# EasyEDA Pro project ICE_PRO_V1.0.epro

# Schematic Schematic1
Board Name: Board1; Create Date: 2025-08-09; Page Name: P1; Project Name: FPGA; Schematic Name: Schematic1; Update Date: 2025-08-13; Company: EasyEDA.com; Page Size: A4; Version: V1.0
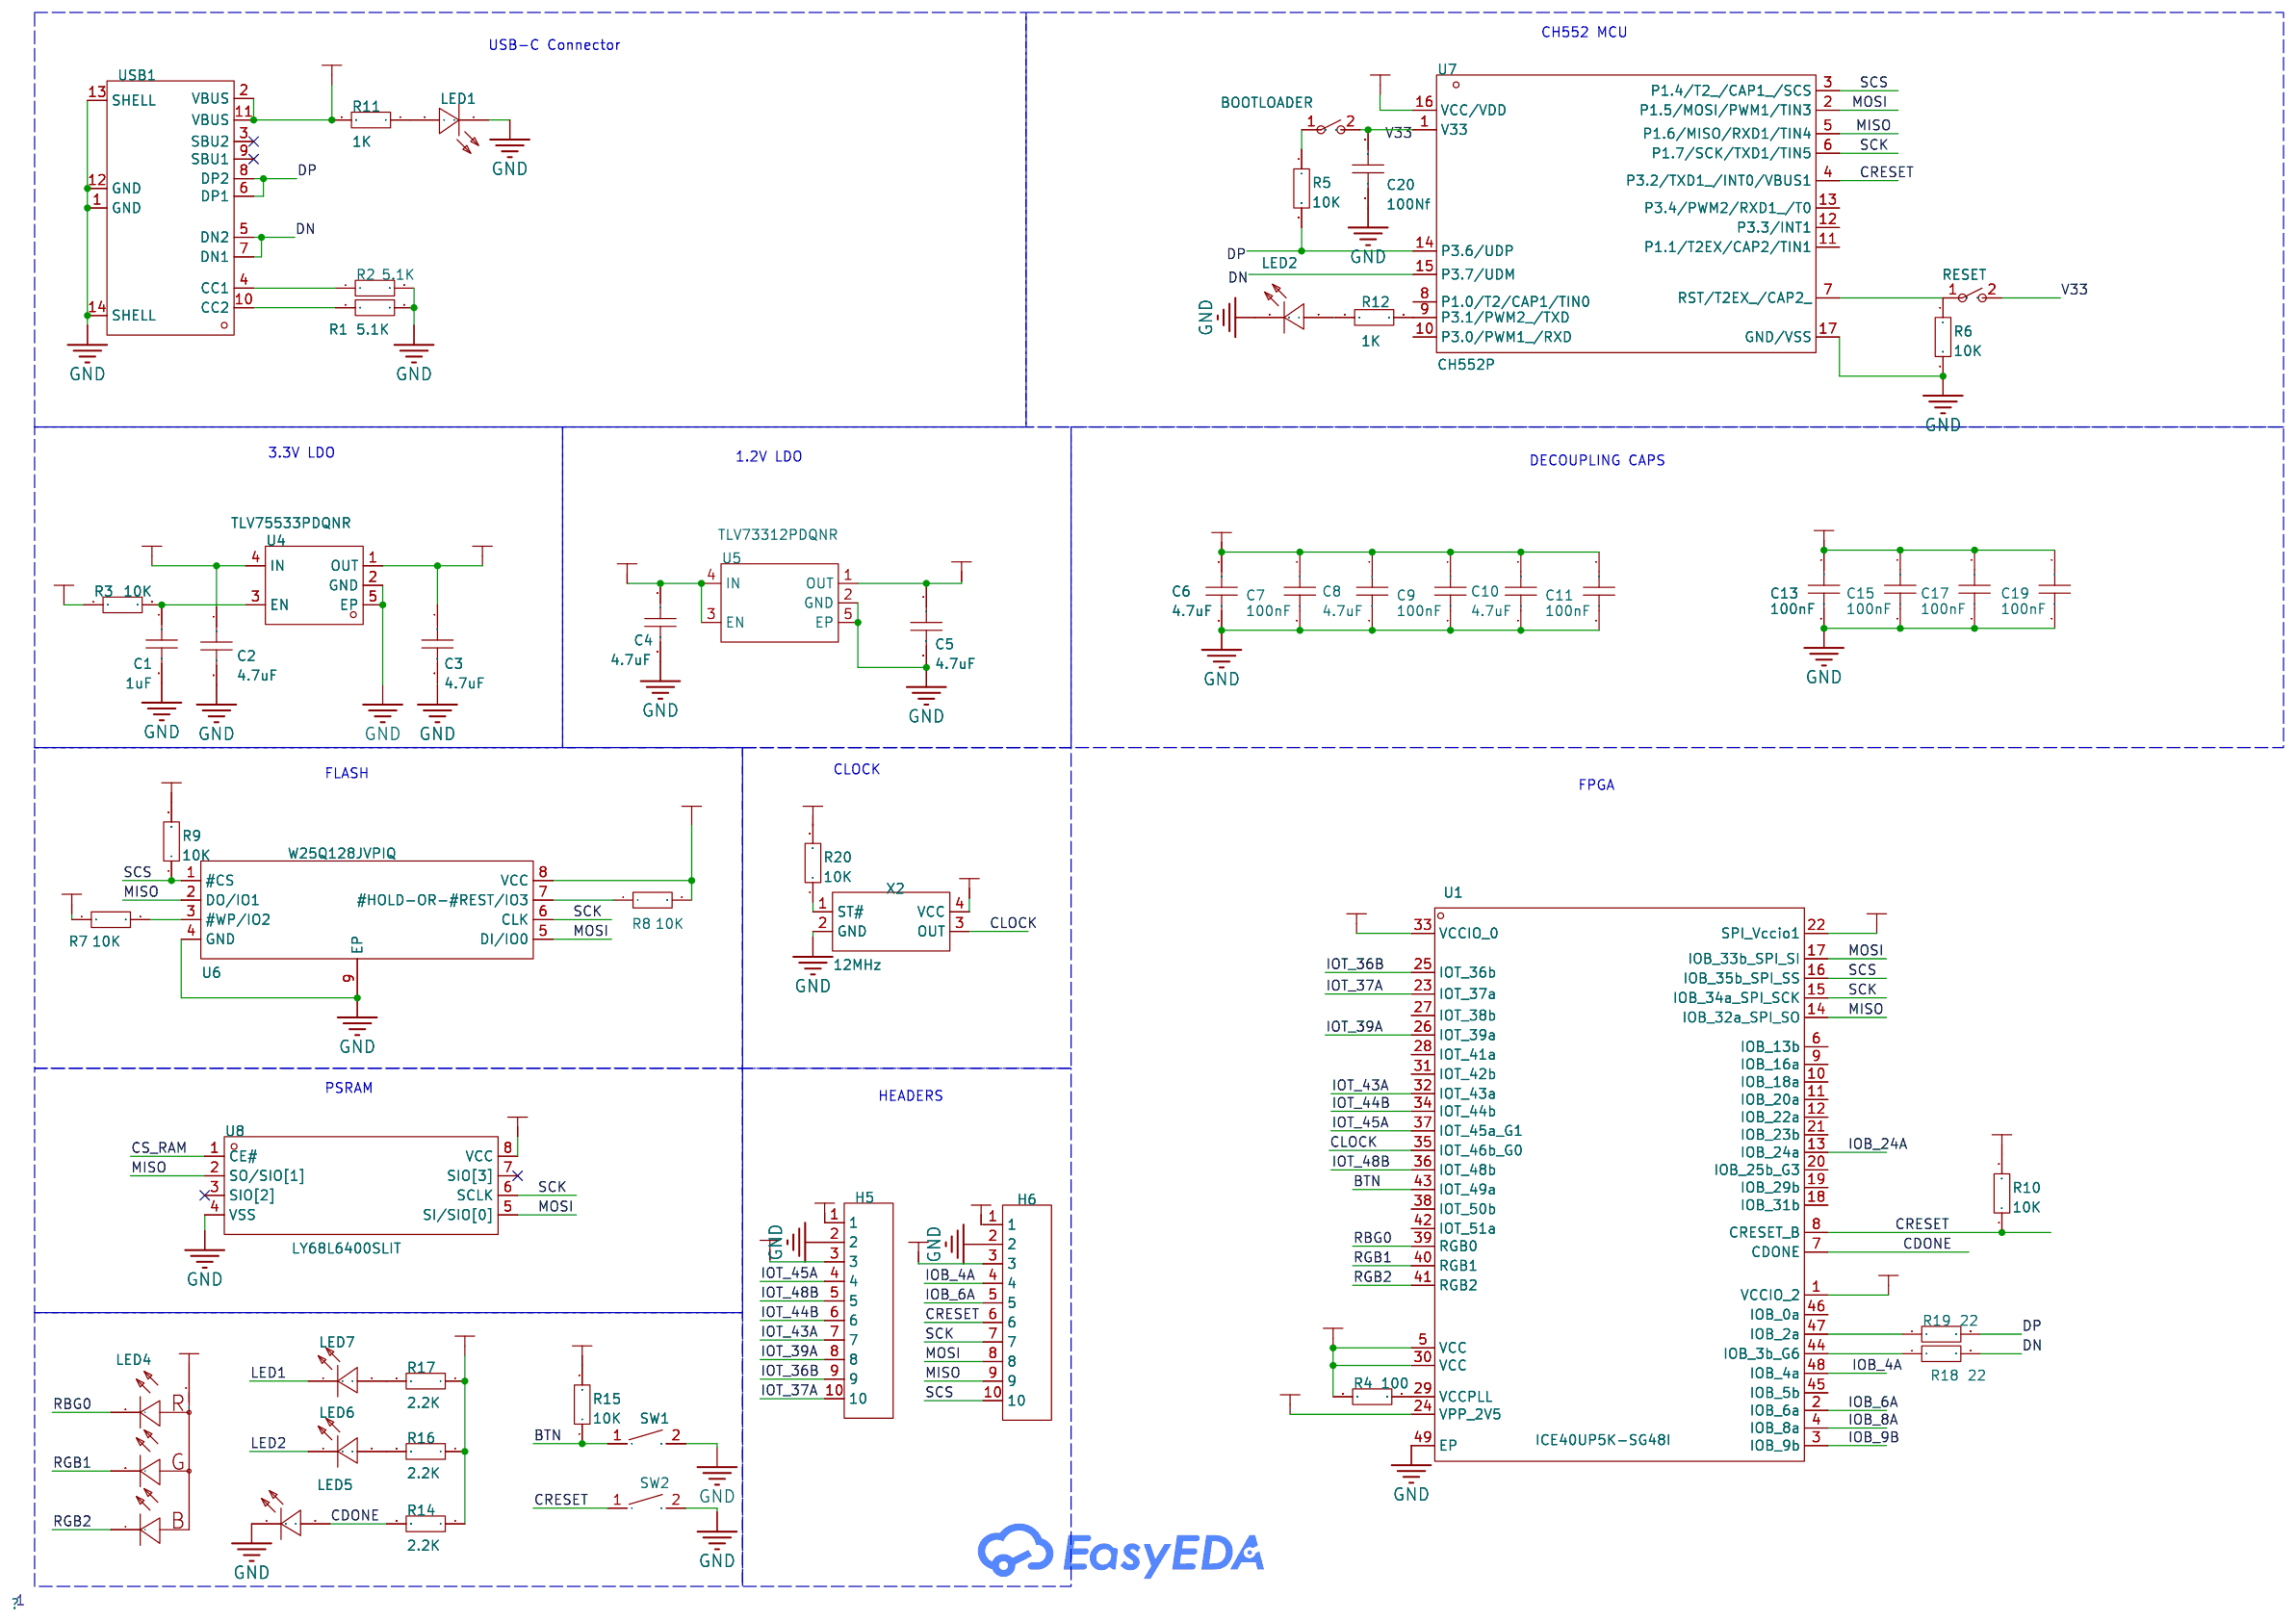
[diagram p0: schematic sheet]

## Parts
BOOTLOADER  -  [Jumper]
C1  1uF  [C0402]
C2  4.7uF  [C0402]
C3  4.7uF  [C0402]
C4  4.7uF  [C0402]
C5  4.7uF  [C0402]
C6  4.7uF  [C0402]
C7  100nF  [C0402]
C8  4.7uF  [C0402]
C9  100nF  [C0402]
C10  4.7uF  [C0402]
C11  100nF  [C0402]
C13  100nF  [C0402]
C15  100nF  [C0402]
C17  100nF  [C0402]
C19  100nF  [C0402]
C20  100Nf  [C0402]
H5  -  [HDR-TH_10P-P2.54-V-M-1]
H6  -  [HDR-TH_10P-P2.54-V-M-1]
LED1  NCD0402G1  [LED0402-RD]
LED2  NCD0402G1  [LED0402-RD]
LED4  MHPA0606RGBDT  [LED-SMD_4P-L0.7-W0.7-BL]
LED5  NCD0402G1  [LED0402-RD]
LED6  NCD0402G1  [LED0402-RD]
LED7  NCD0402G1  [LED0402-RD]
R1  5.1K  [R0402]
R2  5.1K  [R0402]
R3  10K  [R0402]
R4  100  [R0402]
R5  10K  [R0402]
R6  10K  [R0402]
R7  10K  [R0402]
R8  10K  [R0402]
R9  10K  [R0402]
R10  10K  [R0402]
R11  1K  [R0402]
R12  1K  [R0402]
R14  2.2K  [R0402]
R15  10K  [R0402]
R16  2.2K  [R0402]
R17  2.2K  [R0402]
R18  22  [R0402]
R19  22  [R0402]
R20  10K  [R0402]
RESET  -  [Jumper]
SW1  TS-1088-AR02016  [SW-SMD_L3.9-W3.0-P4.45]
SW2  TS-1088-AR02016  [SW-SMD_L3.9-W3.0-P4.45]
U1  ICE40UP5K-SG48I  [QFN-48_L7.0-W7.0-P0.50-TL-EP5.4-1]
U4  TLV75533PDQNR  [X2SON-4_L1.0-W1.0-P0.65-TL-EP]
U5  TLV73312PDQNR  [X2SON-4_L1.0-W1.0-P0.65-TL-EP]
U6  W25Q128JVPIQ  [WSON-8_L6.0-W5.0-P1.27-BL-EP]
U7  CH552P  [VQFN-16_L3.0-W3.0-P0.50-BL-EP1.7]
U8  LY68L6400SLIT  [SOP-8_L4.9-W3.9-P1.27-LS6.0-BL]
USB1  TYPE-C 16PIN 2MD(073)  [USB-C-SMD_TYPE-C-6PIN-2MD-073]
X2  12MHz  [OSC-SMD_4P-L2.5-W2.0-BL]

## Library data of the parts
BOOTLOADER RESET = Jumper
C1-C11 C13 C15 C17 C19 C20 = CAP_0402: Supplier Part: C1525; Supplier Footprint: 0402
H5 H6 = HDR-M_2.54_1x10P: Supplier Footprint: Through
LED1 LED2 LED5-LED7 = NCD0402G1: Emitted Color:Emerald Forward Voltage (VF):2.6V~3.6V Forward Voltage (VF):2.6V~3.6V Power Dissipation:72mW Forward Current:5mA Dominant Wavelength:515nm~530nm Dominant Wavelength:515nm~530nm Lens Color:无色透明透镜 Luminous Intensity:100mcd~270mcd Luminous Inte; Supplier Part: C130723; Manufacturer: 国星光电; Supplier Footprint: 0402; Datasheet: https://atta.szlcsc.com/upload/public/pdf/source/20200820/C130723_D39B4171A1B8D8D2F39C1DC521C0922A.pdf; Supplier: LCSC; Emitted Color: Emerald; Forward Voltage (VF): 2.6V~3.6V; Power Dissipation: 72mW; Forward Current: 5mA; Dominant Wavelength: 515nm~530nm; Lens Color: 无色透明透镜; Luminous Intensity: 100mcd~270mcd; Viewing Angle: 130°; Operating Temperature: -30℃~+85℃
LED4 = MHPA0606RGBDT: Diode Configuration:Common Anode Viewing Angle:115° Lens Color:Misty Black Lens Operating Temperature:-40℃~+85℃ Operating Temperature:-40℃~+85℃; LCSC Part Name: RGB三色; Supplier Part: C404278; Manufacturer: MEIHUA(美华); Supplier Footprint: SMD-4P,0.7x0.7mm; Datasheet: https://atta.szlcsc.com/upload/public/pdf/source/20190830/C404278_3337AEE9091A4B22E4C2DEF188E64997.pdf; Supplier: LCSC; Diode Configuration: Common Anode; Viewing Angle: 115°; Lens Color: Misty Black Lens; Operating Temperature: -40℃~+85℃
R1-R12 R14-R20 = Res_0402: Supplier Footprint: 0402
SW1 SW2 = TS-1088-AR02016: Circuit:SPST Actuator Style:Round Button Operating Force:160gf Mounting Style:Brick nogging Switch Length:4mm Switch Width:3mm Switch Height:2mm Strike Gundam:不带 Contact Current:50mA Voltage Rating (DC):12V Insulation Resistance:100MΩ Actuator/Cap Color:B; LCSC Part Name: 4*3*2mm 立贴 轻触开关; Supplier Part: C720477; Manufacturer: XUNPU(讯普); Supplier Footprint: SMD; JLCPCB Part Class: Basic Part; Datasheet: https://atta.szlcsc.com/upload/public/pdf/source/20200810/C720475_60D09DD6C54279ADDB2DC25100F1CC11.pdf; Supplier: LCSC; Circuit: SPST; Actuator Style: Round Button; Operating Force: 160gf; Mounting Style: Brick nogging; Switch Length: 4mm; Switch Width: 3mm; Switch Height: 2mm; Strike Gundam: 不带; Contact Current: 50mA; Voltage Rating (DC): 12V; Insulation Resistance: 100MΩ; Actuator/Cap Color: Black; Pin Style: SMDSplicing; Mechanical Life: 10万次; Operating Temperature: -30℃~+80℃
U1 = ICE40UP5K-SG48I: Type:- Supply Voltage Range - VCCIO:- Supply Voltage Range - VCCIO:- Logic Elements / Cells:5280 Logic Array Blocks:660 Embedded Block RAM:1171456bit Operating Temperature Range:-40℃~+100℃ Operating Temperature Range:-40℃~+100℃; LCSC Part Name: ICE40UP5K SG48I; Supplier Part: C2678152; Manufacturer: LATTICE(莱迪思); Supplier Footprint: QFN-48-EP(7x7); Datasheet: https://atta.szlcsc.com/upload/public/pdf/source/20210913/C2889329_82E663D90B49CAF53877542F8A43E4F7.pdf; Supplier: LCSC; Logic Elements / Cells: 5280; Logic Array Blocks: 660; Embedded Block RAM: 1171456bit; Operating Temperature Range: -40℃~+100℃
U4 = TLV75533PDQNR: Output Type:Fixed Maximum Input Voltage:5.5V Output Voltage:3.3V Output Voltage:3.3V Output Current:500mA Power Supply Rejection Ratio (PSRR):60dB@(1kHz) Operating Temperature:-40℃~+125℃@(Tj) Operating Temperature:-40℃~+125℃@(Tj) Output Polarity:Positive; LCSC Part Name: 具有使能功能的 500mA、高 PSRR、低 IQ、低压降稳压器; Supplier Part: C2861882; Manufacturer: TI(德州仪器); Supplier Footprint: X2-SON-4-EP(1x1); Datasheet: https://www.ti.com/cn/lit/gpn/tlv755p; Supplier: LCSC; Output Type: Fixed; Maximum Input Voltage: 5.5V; Output Voltage: 3.3V; Output Current: 500mA; Power Supply Rejection Ratio (PSRR): 60dB@(1kHz); Operating Temperature: -40℃~+125℃@(Tj); Output Polarity: Positive electrode; Number of Outputs: 1
U5 = TLV73312PDQNR: Output Type:Fixed Voltage - Supply:5.5V Output Voltage:1.2V Output Voltage:1.2V Output Current:300mA Power Supply Rejection Ratio (PSRR):50dB@(1kHz) Voltage Dropout:450mV@(300mA) standby current:34uA Noise:120uVrms Features:Enable；Thermal Shutdown；Over Cu; LCSC Part Name: 具有使能功能的 300mA、低 IQ、低压降无电容稳压器; Supplier Part: C2859794; Manufacturer: TI(德州仪器); Supplier Footprint: X2-SON-4-EP(1x1); Datasheet: https://www.ti.com/cn/lit/gpn/tlv733p; Supplier: LCSC; Output Type: Fixed; Voltage - Supply: 5.5V; Output Voltage: 1.2V; Output Current: 300mA; Power Supply Rejection Ratio (PSRR): 50dB@(1kHz); Voltage Dropout: 450mV@(300mA); standby current: 34uA; Noise: 120uVrms; Features: Enable；Thermal Shutdown；Over Current Protection; Operating Temperature: -40℃~+125℃@(Tj); Output Configuration: Positive; Number of Outputs: 1
U6 = W25Q128JVPIQ: Interface:SPI Memory Size:- Clock Frequency:133MHz Voltage - Supply:2.7V~3.6V Voltage - Supply:2.7V~3.6V Program / Erase Cycles:100,000 Cycles Page Programming Time (Tpp):- Block Erase Time(tBE):120ms@(32KB) Data Retention - TDR (Year):20 Years Operating; Supplier Part: C190862; Manufacturer: Winbond(华邦); Supplier Footprint: WSON-8-EP(5x6); Datasheet: https://atta.szlcsc.com/upload/public/pdf/source/20190705/C401662_06B6D416F67ED315879B366F63A3F7C9.pdf; Supplier: LCSC; Interface: SPI; Clock Frequency: 133MHz; Voltage - Supply: 2.7V~3.6V; Program / Erase Cycles: 100,000 Cycles; Block Erase Time(tBE): 120ms@(32KB); Data Retention - TDR (Year): 20 Years
U7 = CH552P: Supplier Part: C968536; Manufacturer: WCH(南京沁恒); Supplier Footprint: QFN-16; JLCPCB Part Class: Extended Part; Datasheet: https://atta.szlcsc.com/upload/public/pdf/source/20200819/C111292_2988E0DDEDF937C7B5A075A68BF2AC9C.pdf; Supplier: LCSC
U8 = LY68L6400SLIT: Supplier Part: C261881; Manufacturer: Lyontek(来扬); Supplier Footprint: SOP-8; Datasheet: https://atta.szlcsc.com/upload/public/pdf/source/20240911/02969F97DA313F70EF438339C2DAB58E.pdf; Supplier: LCSC
USB1 = TYPE-C 16PIN 2MD(073): Connector Type:Type-C Protocol Standard:USB 3.1 Gender:Female Mounting Type:Surface Mount, Right Angle Number of Contacts:16P Number of Ports:1 Current Rating-Power:3A Voltage Rating:5V Connect-Disconnect Life:5,000 Cycles Supplementary Features:- Center; LCSC Part Name: Type-C 母 卧贴; Supplier Part: C2765186; Manufacturer: SHOU HAN(首韩); Supplier Footprint: SMD; JLCPCB Part Class: Extended Part; Datasheet: https://item.szlcsc.com/datasheet/TYPE-C%252016PIN%25202MD(073)/2901843.html; Supplier: LCSC; Connector Type: Type-C; Protocol Standard: USB 3.1; Gender: Female; Mounting Type: Surface Mount, Right Angle; Number of Contacts: 16P; Number of Ports: 1; Current Rating-Power: 3A; Voltage Rating: 5V; Connect-Disconnect Life: 5,000 Cycles; Detection color: Black; Operating Temperature: -25℃~+85℃
X2 = X1G0041710018: Frequency:12MHz Normal temperature Frequency Tolerance:±50ppm Normal temperature Frequency Tolerance:±50ppm Output Type:CMOS Voltage - Supply:1.62V~3.63V Voltage - Supply:1.62V~3.63V Current - Supply:1.8mA Operating Temperature:-40℃~+85℃ Operating Tempera; LCSC Part Name: X1G004171001800; Supplier Part: C255991; Manufacturer: EPSON(爱普生); Supplier Footprint: SMD2520-4P; Datasheet: https://atta.szlcsc.com/upload/public/pdf/source/20240417/F9B89BA86168BF22DBC25C3B93427618.pdf; Supplier: LCSC; Normal temperature Frequency Tolerance: ±50ppm; Output Type: CMOS; Voltage - Supply: 1.62V~3.63V; Current - Supply: 1.8mA; Operating Temperature: -40℃~+85℃

## Nets
+1.2V: C5.1 C6.1 C7.1 C8.1 C9.1 C10.1 C11.1 H6.3 R4.1 U1.5(VCC) U1.30(VCC) U5.1(OUT)
+3V3: C3.1 C13.1 C15.1 C17.1 C19.1 H5.3 LED4.1(+) R7.1 R8.2 R9.2 R10.2 R14.1 R15.2 R16.1 R17.1 R20.2 U1.1(VCCIO_2) U1.22(SPI_Vccio1) U1.24(VPP_2V5) U1.33(VCCIO_0) U4.1(OUT) U6.8(VCC) U8.8(VCC) X2.4(VCC)
GND: C1.2 C2.2 C3.2 C4.2 C5.2 C6.2 C7.2 C8.2 C9.2 C10.2 C11.2 C13.2 C15.2 C17.2 C19.2 C20.1 H5.2 H6.2 LED1.1(K) LED2.1(K) LED5.1(K) R1.2 R2.2 R6.2 SW1.2 SW2.2 U1.49(EP) U4.2(GND) U4.5(EP) U5.2(GND) U5.5(EP) U6.4(GND) U6.9(EP) U7.17(GND/VSS) U8.4(VSS) USB1.1(GND) USB1.12(GND) USB1.13(SHELL) USB1.14(SHELL) X2.2(GND)
V33: C20.2 U7.1(V33)
VBUS: C2.1 C4.1 H5.1 H6.1 R3.1 R11.2 U4.4(IN) U5.3(EN) U5.4(IN) U7.16(VCC/VDD) USB1.2(VBUS) USB1.11(VBUS)
BTN: R15.1 SW1.1 U1.43(IOT_49a)
CDONE: LED5.2(A) R14.2 U1.7(CDONE)
CLOCK: U1.35(IOT_46b_G0) X2.3(OUT)
CRESET: H6.6 R10.1 SW2.1 U1.8(CRESET_B) U7.4(P3.2/TXD1_/INT0/VBUS1)
CS_RAM: U8.1(CE#)
DN: R18.2 U7.15(P3.7/UDM) USB1.5(DN2) USB1.7(DN1)
DP: R5.2 R19.2 U7.14(P3.6/UDP) USB1.6(DP1) USB1.8(DP2)
IOB_4A: H6.4 U1.48(IOB_4a)
IOB_6A: H6.5 U1.2(IOB_6a)
IOB_8A: U1.4(IOB_8a)
IOB_9B: U1.3(IOB_9b)
IOB_24A: U1.13(IOB_24a)
IOT_36B: H5.9 U1.25(IOT_36b)
IOT_37A: H5.10 U1.23(IOT_37a)
IOT_39A: H5.8 U1.26(IOT_39a)
IOT_43A: H5.7 U1.32(IOT_43a)
IOT_44B: H5.6 U1.34(IOT_44b)
IOT_45A: H5.4 U1.37(IOT_45a_G1)
IOT_48B: H5.5 U1.36(IOT_48b)
LED1: LED7.1(K)
LED2: LED6.1(K)
MISO: H6.9 U1.14(IOB_32a_SPI_SO) U6.2(DO/IO1) U7.5(P1.6/MISO/RXD1/TIN4) U8.2(SO/SIO[1])
MOSI: H6.8 U1.17(IOB_33b_SPI_SI) U6.5(DI/IO0) U7.2(P1.5/MOSI/PWM1/TIN3) U8.5(SI/SIO[0])
RBG0: LED4.2(-) U1.39(RGB0)
RGB1: LED4.3(-) U1.40(RGB1)
RGB2: LED4.4(-) U1.41(RGB2)
SCK: H6.7 U1.15(IOB_34a_SPI_SCK) U6.6(CLK) U7.6(P1.7/SCK/TXD1/TIN5) U8.6(SCLK)
SCS: H6.10 R9.1 U1.16(IOB_35b_SPI_SS) U6.1(#CS) U7.3(P1.4/T2_/CAP1_/SCS)
$1N838: R2.1 USB1.4(CC1)
$1N2580: C1.1 R3.2 U4.3(EN)
$1N10655: R7.2 U6.3(#WP/IO2)
$1N10681: R8.1 U6.7(#HOLD-OR-#REST/IO3)
$1N13098: R1.1 USB1.10(CC2)
$1N13176: LED1.2(A) R11.1
$1N14812: R4.2 U1.29(VCCPLL)
$1N18803: LED6.2(A) R16.2
$1N18868: LED7.2(A) R17.2
$1N23642: R20.1 X2.1(ST#)
$1N41099: LED2.2(A) R12.1
$1N42332: R18.1 U1.44(IOB_3b_G6)
$1N42360: R19.1 U1.47(IOB_2a)
Net-(R6-1): R6.1 U7.7(RST/T2EX_/CAP2_)

Not connected (* = marked no-connect by the designer): BOOTLOADER 1 2; R5 1; R12 2; RESET 1 2; U1 6(IOB_13b) 9(IOB_16a) 10(IOB_18a) 11(IOB_20a) 12(IOB_22a) 18(IOB_31b) 19(IOB_29b) 20(IOB_25b_G3) 21(IOB_23b) 27(IOT_38b) 28(IOT_41a) 31(IOT_42b) 38(IOT_50b) 42(IOT_51a) 45(IOB_5b) 46(IOB_0a); U7 8(P1.0/T2/CAP1/TIN0) 9(P3.1/PWM2_/TXD) 10(P3.0/PWM1_/RXD) 11(P1.1/T2EX/CAP2/TIN1) 12(P3.3/INT1) 13(P3.4/PWM2/RXD1_/T0); U8 3(SIO[2])* 7(SIO[3])*; USB1 3(SBU2)* 9(SBU1)*

## Notes on the sheet
- CH552 MCU
- USB-C Connector
- 3.3V LDO
- 1.2V LDO
- DECOUPLING CAPS
- FLASH
- CLOCK
- FPGA
- PSRAM
- HEADERS

# Board PCB1
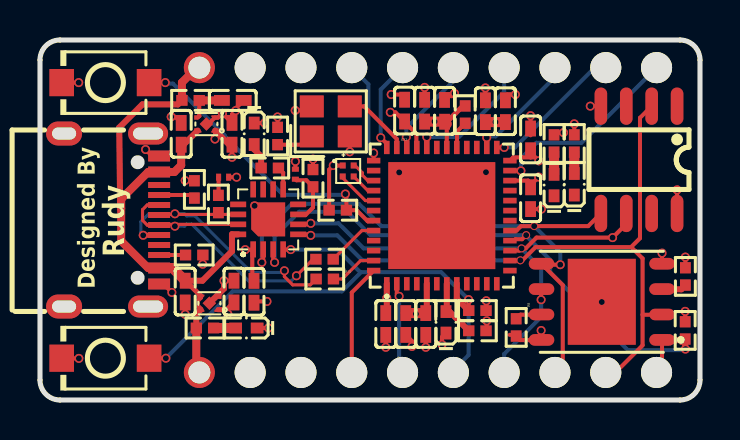
[diagram p1: board, top side]
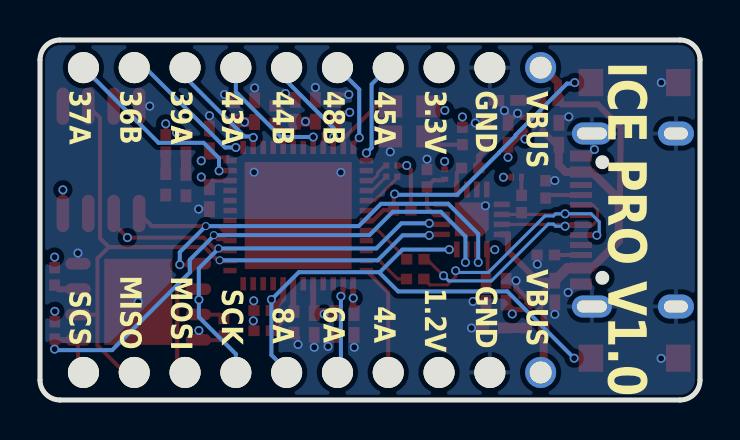
[diagram p2: board, bottom side, seen from below]

Outline 33 x 18 mm; copper layers: Top Layer, Inner1, Inner2, Bottom Layer. Coordinates in mm from the lower left corner of the outline.
Outline path: 0,17 0,1 arc(0.29,0.29) 1,0 32,0 arc(32.71,0.29) 33,1 33,17 arc(32.71,17.71) 32,18 1,18 arc(0.29,17.71) 0,17
Stack: Top Layer 0.035mm Outer layer thickness 1oz / Dielectric1 0.2104mm 7628 RC49% 8.6mil / Inner1 0.0152mm Inner layer thickness / Dielectric2 1.065mm 1.1mm H/HOZ Copper / Inner2 0.0152mm Inner layer thickness / Dielectric3 0.2104mm 7628 RC49% 8.6mil / Bottom Layer 0.035mm Outer layer thickness 1oz

## Design rules (mm)
net DN: DP1
net DP: DP1
net $1N42332: DP2
net $1N42360: DP2
template: Custom Config
spacing copperThickness1oz (default): track to track 0.102, other pairs 0.152 to 0.3
spacing copperThickness2oz: track to track 0.203, other pairs 0.152 to 0.3
track width copperThickness1oz (default): min 0.127, default 0.2, max 2.54
track width copperThickness2oz: min 0.203, default 0.254, max 2.54
differential pair differentialPair (default): width min 0.127, default 0.254, max 2.54; gap min 0.152, default 0.152
via viaSize (default): diameter min 0.4, default 0.45, max 10; hole min 0.3, default 0.3, max 6.3

## Placement (name value [footprint] x y rotation side)
BOOTLOADER  -  [Jumper]  8.73 10.94 270 top
C1  1uF  [C0402]  9.64 14.98 0 top
C2  4.7uF  [C0402]  7.06 13.31 90 top
C3  4.7uF  [C0402]  9.6 13.31 90 top
C4  4.7uF  [C0402]  7.26 5.42 270 top
C5  4.7uF  [C0402]  9.7 5.42 90 top
C6  4.7uF  [C0402]  18.29 3.8 270 top
C7  100nF  [C0402]  19.29 3.8 270 top
C8  4.7uF  [C0402]  19.23 14.47 90 top
C9  100nF  [C0402]  20.23 14.46 90 top
C10  4.7uF  [C0402]  22.27 14.44 90 top
C11  100nF  [C0402]  23.27 14.44 90 top
C13  100nF  [C0402]  18.23 14.47 90 top
C15  100nF  [C0402]  24.53 10.09 270 top
C17  100nF  [C0402]  17.29 3.8 270 top
C19  100nF  [C0402]  24.53 13.03 90 top
C20  100Nf  [C0402]  10.7 5.41 90 top
H5  -  [HDR-TH_10P-P2.54-V-M-1]  19.4 16.62 0 top
H6  -  [HDR-TH_10P-P2.54-V-M-1]  19.4 1.38 0 top
LED1  NCD0402G1  [LED0402-RD]  10.32 3.6 180 top
LED2  NCD0402G1  [LED0402-RD]  10.71 13.31 270 top
LED4  MHPA0606RGBDT  [LED-SMD_4P-L0.7-W0.7-BL]  15.41 11.45 270 top
LED5  NCD0402G1  [LED0402-RD]  20.3 3.88 90 top
LED6  NCD0402G1  [LED0402-RD]  26.71 10.79 90 top
LED7  NCD0402G1  [LED0402-RD]  25.7 10.75 90 top
R1  5.1K  [R0402]  7.71 7.25 0 top
R2  5.1K  [R0402]  7.72 10.53 90 top
R3  10K  [R0402]  7.53 14.98 0 top
R4  100  [R0402]  21.26 14.27 270 top
R5  10K  [R0402]  8.92 9.8 270 top
R6  10K  [R0402]  13.65 11.09 90 top
R7  10K  [R0402]  32.27 6.18 270 top
R8  10K  [R0402]  23.81 3.63 270 top
R9  10K  [R0402]  32.26 3.48 90 top
R10  10K  [R0402]  21.87 4.47 0 top
R11  1K  [R0402]  8.25 3.6 180 top
R12  1K  [R0402]  11.49 11.6 0 top
R14  2.2K  [R0402]  21.87 3.46 180 top
R15  10K  [R0402]  14.89 9.49 180 top
R16  2.2K  [R0402]  26.71 12.83 270 top
R17  2.2K  [R0402]  25.7 12.83 270 top
R18  22  [R0402]  14.23 7.04 180 top
R19  22  [R0402]  14.24 6.05 180 top
R20  10K  [R0402]  11.88 13.2 90 top
RESET  -  [Jumper]  12.97 10.84 0 top
SW1  TS-1088-AR02016  [SW-SMD_L3.9-W3.0-P4.45]  3.27 15.87 180 top
SW2  TS-1088-AR02016  [SW-SMD_L3.9-W3.0-P4.45]  3.27 2.09 180 top
U1  ICE40UP5K-SG48I  [QFN-48_L7.0-W7.0-P0.50-TL-EP5.4-1]  20.09 9.22 90 top
U4  TLV75533PDQNR  [X2SON-4_L1.0-W1.0-P0.65-TL-EP]  8.32 13.8 180 top
U5  TLV73312PDQNR  [X2SON-4_L1.0-W1.0-P0.65-TL-EP]  8.47 4.84 180 top
U6  W25Q128JVPIQ  [WSON-8_L6.0-W5.0-P1.27-BL-EP]  28.09 4.91 90 top
U7  CH552P  [VQFN-16_L3.0-W3.0-P0.50-BL-EP1.7]  11.41 9.03 0 top
U8  LY68L6400SLIT  [SOP-8_L4.9-W3.9-P1.27-LS6.0-BL]  29.95 12.01 180 top
USB1  TYPE-C 16PIN 2MD(073)  [USB-C-SMD_TYPE-C-6PIN-2MD-073]  3.58 9 270 top
X2  12MHz  [OSC-SMD_4P-L2.5-W2.0-BL]  14.54 13.93 0 top

## Footprints (pads in the part's own frame, mm; a bottom-side part is the same pattern mirrored in y, then rotated)
C0402
  rect 0.79x0.54 smd: 1(-0.545,0) 2(0.545,0)
HDR-TH_10P-P2.54-V-M-1
  round 1.55 hole 1.1x1.6: 1(-11.43,0)
  round 1.55 hole 1.6x1.1: 2(-8.89,0) 3(-6.35,0) 4(-3.81,0) 5(-1.27,0) 6(1.27,0) 7(3.81,0) 8(6.35,0) 9(8.89,0) 10(11.43,0)
Jumper
  custom 0.35x0.25 smd: 1(-0.2,0.2) 2(-0.2,0.7)
LED0402-RD
  rect 0.636x0.54 smd: 1(-0.538,0) 2(0.538,0)
LED-SMD_4P-L0.7-W0.7-BL
  rect 0.3x0.3 smd: 1(-0.275,-0.275) 2(-0.275,0.275) 3(0.275,0.275) 4(0.275,-0.275)
OSC-SMD_4P-L2.5-W2.0-BL
  rect 1.2x1.1 smd: 1(-0.95,-0.75) 2(0.95,-0.75) 3(0.95,0.75) 4(-0.95,0.75)
QFN-48_L7.0-W7.0-P0.50-TL-EP5.4-1
  rect 0.665x0.28 smd: 1(-3.408,2.75) 2(-3.408,2.25) 3(-3.408,1.75) 4(-3.408,1.25) 5(-3.408,0.75) 6(-3.408,0.25) 7(-3.408,-0.25) 8(-3.408,-0.75) 9(-3.408,-1.25) 10(-3.408,-1.75) 11(-3.408,-2.25) 12(-3.408,-2.75) 25(3.408,-2.75) 26(3.408,-2.25) 27(3.408,-1.75) 28(3.408,-1.25) 29(3.408,-0.75) 30(3.408,-0.25) 31(3.408,0.25) 32(3.408,0.75) 33(3.408,1.25) 34(3.408,1.75) 35(3.408,2.25) 36(3.408,2.75)
  rect 0.28x0.665 smd: 13(-2.75,-3.408) 14(-2.25,-3.408) 15(-1.75,-3.408) 16(-1.25,-3.408) 17(-0.75,-3.408) 18(-0.25,-3.408) 19(0.25,-3.408) 20(0.75,-3.408) 21(1.25,-3.408) 22(1.75,-3.408) 23(2.25,-3.408) 24(2.75,-3.408) 37(2.75,3.408) 38(2.25,3.408) 39(1.75,3.408) 40(1.25,3.408) 41(0.75,3.408) 42(0.25,3.408) 43(-0.25,3.408) 44(-0.75,3.408) 45(-1.25,3.408) 46(-1.75,3.408) 47(-2.25,3.408) 48(-2.75,3.408)
  rect 5.35x5.35 smd: 49(0,0)
R0402
  rect 0.566x0.54 smd: 1(-0.433,0) 2(0.433,0)
SOP-8_L4.9-W3.9-P1.27-LS6.0-BL
  oval 0.63x1.865 smd: 1(-1.905,-2.683) 2(-0.635,-2.683) 3(0.635,-2.683) 4(1.905,-2.683) 5(1.905,2.683) 6(0.635,2.683) 7(-0.635,2.683) 8(-1.905,2.683)
SW-SMD_L3.9-W3.0-P4.45
  rect 1.23x1.36 smd: 1(-2.185,0) 2(2.185,0)
USB-C-SMD_TYPE-C-6PIN-2MD-073
  rect 0.55x1.1 smd: 1(-3.2,2.375) 2(-2.4,2.375) 11(2.4,2.375) 12(3.2,2.375)
  rect 0.3x1.1 smd: 3(-1.75,2.375) 4(-1.25,2.375) 5(-0.75,2.375) 6(-0.25,2.375) 7(0.25,2.375) 8(0.75,2.375) 9(1.25,2.375) 10(1.75,2.375)
  oval 1.1x2 hole 0.6x1.5: 13(-4.325,1.825) 14(4.325,1.825)
  oval 1.2x1.8 hole 0.6x1.2: 13(-4.325,-2.375) 14(4.325,-2.375)
VQFN-16_L3.0-W3.0-P0.50-BL-EP1.7
  rect 0.28x0.8 smd: 1(-0.749,-1.5) 2(-0.249,-1.5) 3(0.249,-1.5) 4(0.75,-1.5) 9(0.75,1.5) 10(0.249,1.5) 11(-0.249,1.5) 12(-0.749,1.5)
  rect 0.8x0.28 smd: 5(1.5,-0.749) 6(1.5,-0.249) 7(1.5,0.249) 8(1.5,0.75) 13(-1.5,0.75) 14(-1.5,0.249) 15(-1.5,-0.249) 16(-1.5,-0.749)
  custom 1.7x1.7 smd: 17(0,0)
WSON-8_L6.0-W5.0-P1.27-BL-EP
  oval 0.581x1.276 smd: 1(-1.905,-3.013) 2(-0.635,-3.013) 3(0.635,-3.013) 4(1.905,-3.013) 5(1.905,3.013) 6(0.635,3.013) 7(-0.635,3.013) 8(-1.905,3.013)
  rect 4.3x3.4 smd: 9(0,0)
X2SON-4_L1.0-W1.0-P0.65-TL-EP
  custom 0.36x0.22 smd: 1(-0.43,0.325) 2(-0.43,-0.325) 3(0.43,-0.325) 4(0.43,0.325)
  rect 0.48x0.48 smd rot 45: 5(0,0)

## Nets
As in the schematic, except:
V33: BOOTLOADER.2 C20.2 RESET.2 U7.1
$1N7399: BOOTLOADER.1 R5.1
$1N8911: R6.1 RESET.1 U7.7
$1N41101: R12.2 U7.9

Pads without a net: U1 6 9 10 11 12 18 19 20 21 27 28 31 38 42 45 46; U7 8 10 11 12 13; U8 3 7; USB1 3 9

## Via types
v1: diameter 0.45, hole 0.3, Top Layer to Bottom Layer, 83 vias
v2: diameter 0.4, hole 0.3, Top Layer to Bottom Layer, 4 vias

## Routing (per net, layer and track width the routed paths; a pad name or vN(x,y) marks a point on that pad's centre or on a via; arc(x,y) is an arc through that point)
+1.2V: length 34.5
  Top Layer w0.2: 20.34,13.8 U1.30
  Top Layer w0.25: R4.1 21.15,14.7 20.36,13.92 ; 9.34,4.52 C5.1 ; 9.18,4.52 9.34,4.52 ; 9.18,4.52 v1(9.39,4.3) ; 9.18,4.52 U5.1
  Top Layer w0.299: C7.1 19.34,4.4 U1.5
  Top Layer w0.5: C11.1 v1(22.77,13.9) C10.1 ; 20.34,13.8 C9.1 20.22,13.92 v1(19.73,13.92) C8.1 ; C7.1 C6.1
  Inner2 w0.5: v1(22.77,13.9) 20.91,13.9 20.33,13.32 ; v1(9.39,4.3) 11.63,4.3 ; 11.63,4.3 13.05,2.89 H6.3 ; 11.63,4.3 v1(18.8,4.3) 19,4.3 20.33,5.63 20.33,13.34 19.75,13.92 v1(19.73,13.92)
+3V3: length 20.6
  Top Layer w0.2: v1(24.94,11.15) 24.64,10.85 ; v1(11.88,14.15) R20.2 ; 23.49,3.26 23.74,3.26 24,3 25.08,3 25.06,3.02 v1(25.06,3.48) ; R15.2 14.46,11.52 v1(14.66,11.73) LED4.1 ; 24.53,12.13 23.66,12.13 U1.24 ; 24.53,12.13 24.77,12.13 v1(24.94,11.96) ; 24.53,12.13 C19.1 ; R14.1 22.34,3.49 v1(22.34,3.96) ; 24.64,10.85 24.53,10.85 24.41,10.97 U1.22 ; R10.2 22.31,4.48 v1(22.31,4.96) ; C3.1 v1(9.6,12.14) ; C15.1 24.53,10.85 ; X2.4 13.39,14.48 v1(12.76,14.48) ; v1(26.71,13.81) R16.1 ; v1(32.26,4.43) 32.26,3.9 ; v1(26.17,13.37) 25.81,13.37 R17.1 ; U1.33 18.82,12.65 18.82,13.31 ; 18.82,13.31 18.23,13.9 C13.1 17.77,14.39 v1(17.52,14.39) ; v1(31.85,10.51) U8.8 ; v1(32.27,7.15) 32.27,6.6 ; U4.1 8.75,13.05
  Top Layer w0.299: U1.1 v1(17.34,5.1) 17.34,4.4 C17.1 ; 8.76,13.47 9.46,12.77 C3.1
  vias: v1(8.75,13.05)
GND: length 21.6
  Top Layer w0.2: LED2.1 v1(11.23,13.85) ; 18.23,15.2 18.16,15.28 v1(17.56,15.28) ; C10.2 v1(22.27,15.61) ; v1(9.2,5.97) C5.2 ; SW1.2 v1(1.94,15.87) ; R6.2 v1(13.65,12.04) ; v1(20.73,15.33) 20.59,15.19 20.23,15.19 ; v1(11.35,4.93) 10.76,4.93 C20.1 ; X2.2 v1(15.49,12.41) ; v1(6.56,14.16) 6.75,14.16 C2.2 ; v1(23.77,15.28) 23.37,15.28 23.27,15.17 ; LED5.1 20.1,3.15 v1(20.1,2.78) ; v1(7.26,10.97) 7.76,10.97 7.8,10.93 ; R1.2 8.14,6.8 v1(8.13,6.79) ; C4.2 v1(7.26,4.28) ; U4.5 8.42,13.8 U4.2 8.91,14.12 ; v1(5.28,12.52) 5.6,12.2 USB1.1 ; v1(31.1,7.34) 31.1,6.81 ; C15.2 v1(25.07,9.55) ; 24.53,13.23 v1(24.53,14.22) ; v1(18.6,2.68) 18.6,2.95 C6.2 ; 19.23,15.2 v1(19.23,15.63) ; 8.91,14.12 v1(9.12,14.33) ; C1.2 9.78,14.58 v1(9.78,14.47) 9.6,14.28 C3.2 9.12,14.33 ; v1(6.59,5.38) 6.17,5.8 USB1.12 ; LED1.1 v1(11.43,3.6) ; v1(17.29,2.64) C17.2 ; v1(19.29,2.64) C7.2 ; v1(27.51,14.69) U8.4 ; 1.09,2.08 v1(1.94,2.08)
  Top Layer w0.299: v1(9.2,5.97) 9.2,5.57 U5.5
  vias: v1(10.73,9.71) v1(17.96,11.38) v1(22.3,11.39) v1(28.09,4.9)
V33: length 10.5
  Top Layer w0.2: 10.66,7.52 10.66,7.52 ; 10.66,7.52 v1(10.26,7.52) ; 10.66,7.52 10.61,7.47 10.61,6.04 10.7,5.96 ; BOOTLOADER.2 v1(9.83,11.14) ; RESET.2 v1(12.77,11.93)
  Inner2 w0.299: v1(10.26,7.52) 11.63,8.89 11.63,10.1 ; 11.63,10.1 10.59,11.14 v1(9.83,11.14) ; 11.63,10.1 12.77,11.24 v1(12.77,11.93)
VBUS: length 31.5
  Top Layer w0.2: U5.3 8.04,5.11 7.88,4.94 7.88,4.74 8.04,4.57
  Top Layer w0.25: 7.35,5.89 8.04,5.2 ; 8.04,5.2 U5.3
  Top Layer w0.299: C2.1 7.18,12.77 ; C4.1 8.12,5.97 9.6,7.44 9.6,8.28 9.91,8.28 ; 7.18,12.77 7.88,13.47 ; R11.2 7.82,4.29 8.03,4.51
  Top Layer w0.3: R3.1 6.9,14.78 5.12,14.78 3.96,13.62 4.01,9.62 4.06,9.57 4.1,10.09
  Top Layer w0.399: R11.2 7.82,1.53 H6.1 ; 6.72,11.4 USB1.2 5.41,11.4 4.1,10.09 ; USB1.11 5.41,6.6 4.06,7.95 4.06,10.09 ; 4.1,10.09 4.1,10.09 ; R3.1 7.1,15.88 7.84,16.62 ; 6.72,11.4 7.06,11.74 C2.1 ; 7.96,16.69 7.76,16.69
  Top Layer w0.5: USB1.11 6.62,6.6 C4.1
BTN: length 13.8
  Top Layer w0.2: U1.43 16.65,8.94 16.38,8.94 15.83,9.49 R15.1 15.32,10.25 v1(15.27,10.3)
  Bottom Layer w0.2: v1(15.27,10.3) 15.23,10.26 12.15,10.26 10.06,12.35 10.06,12.37 9.23,13.2 9.23,13.25 6.65,15.82 6.31,15.82 v1(6.26,15.87)
CDONE: length 2.9
  Top Layer w0.299: U1.7 20.34,4.46 LED5.2 20.47,4.42 R14.2
CLOCK: length 3.4
  Top Layer w0.2: U1.35 17.84,13.05 16.21,14.68 X2.3
CRESET: length 28.8
  Top Layer w0.2: 12.16,7.52 v1(12.54,7.52) ; v1(21.43,5.02) 21.44,5.01 R10.1 ; SW2.1 v1(6.29,2.09)
  Top Layer w0.299: U1.8 20.84,5.07 R10.1
  Bottom Layer w0.2: v1(6.29,2.09) 9.63,5.43 15.09,5.43 16.05,6.39 ; v1(12.54,7.52) 14.88,7.52 16.01,6.39 16.05,6.39 ; 16.05,6.39 20.06,6.39 v1(21.43,5.02) 21.43,2.25 20.67,1.49 H6.6
DN: length 15
  Top Layer w0.154: 5.99,8.78 9.91,8.78 ; USB1.5 5.36,9.75 5.13,9.52 5.13,8.98 5.37,8.74 5.94,8.74 ; v1(12.82,6.21) 13.65,7.04 13.73,7.04
  Top Layer w0.254: USB1.7 5.94,8.74
  Bottom Layer w0.154: v1(6.75,8.69) 7.22,8.69 7.33,8.8 7.58,8.8 10.42,5.96 12.57,5.96 v1(12.82,6.21)
DP: length 16.3
  Top Layer w0.154: 9.91,9.28 5.98,9.28 USB1.6 ; v1(12.22,6.46) 12.22,6.17 12.63,5.76 13.51,5.76 R19.2
  Top Layer w0.254: v1(5.16,8.24) 5.94,8.24 ; 5.94,8.24 USB1.8
  Bottom Layer w0.154: v1(5.16,8.24) 5.04,8.36 5.04,8.91 5.44,9.31 v1(6.75,9.31) 7.22,9.31 7.33,9.2 7.75,9.2 10.58,6.38 12.14,6.38 v1(12.22,6.46)
IOB_4A: length 5.5
  Top Layer w0.2: H6.4 15.59,5.38 U1.48
IOB_6A: length 4.6
  Top Layer w0.2: U1.2 17.84,5.3 v1(17.96,5.19)
  Bottom Layer w0.2: v1(17.96,5.19) 17.96,1.55 H6.5
IOT_36B: length 7.1
  Top Layer w0.2: U1.25 v1(23.21,12.63)
  Bottom Layer w0.2: v1(23.21,12.63) 23.75,12.63 27.74,16.62 H5.9
IOT_37A: length 9.8
  Top Layer w0.2: U1.23 24.04,11.47 v1(24.05,11.46)
  Bottom Layer w0.2: H5.10 27.07,12.86 24.82,12.86 24.05,12.09 24.05,11.46 v1(24.05,11.46)
IOT_39A: length 5.6
  Top Layer w0.2: U1.26 22.34,13.12 v1(22.34,13.12)
  Bottom Layer w0.2: H5.8 25.75,16.15 22.78,13.18 22.39,13.18 v1(22.34,13.12)
IOT_43A: length 6.5
  Top Layer w0.2: U1.32 v1(19.34,13.15)
  Bottom Layer w0.2: H5.7 23.21,15.41 20.95,13.15 v1(19.34,13.15)
IOT_44B: length 5
  Top Layer w0.2: v1(18.32,13.14) 18.34,13.12 U1.34
  Bottom Layer w0.2: H5.6 20.67,15.94 18.32,13.59 v1(18.32,13.14)
IOT_45A: length 5.1
  Top Layer w0.2: v1(16.68,12.35) U1.37
  Bottom Layer w0.2: v1(16.68,12.35) 16.42,12.61 16.42,15.79 H5.4
IOT_48B: length 4.6
  Top Layer w0.2: v1(17.04,13.12) 17.34,12.82 U1.36
  Bottom Layer w0.2: v1(17.04,13.12) 17.04,15.53 H5.5
MISO: length 34
  Top Layer w0.2: v1(13.54,8.23) 13.49,8.28 U7.5 ; U8.2 30,14.11 30,8.09 29.56,7.65 30.13,7.08 30.13,4.26 ; 30.13,4.26 31.09,4.26 U6.2 ; 30.13,4.26 30.13,2.73 28.89,1.49 ; 28.88,1.49 28.33,1.49 28.29,1.45 H6.9 ; 29.55,7.64 24.78,7.64 24.12,6.98 v2(24.02,6.98) 24,6.97 ; 24,6.97 U1.14
  Bottom Layer w0.2: v1(13.54,8.23) 14.87,8.23 16.12,6.98 v2(24.02,6.98)
MOSI: length 31
  Top Layer w0.2: v2(24.71,8.69) 24.05,8.69 23.83,8.47 ; v1(26.01,6.77) 25.45,6.77 25.28,6.6 ; v1(11.09,6.88) 11.16,6.95 11.16,7.52 ; U1.17 23.82,8.47
  Top Layer w0.201: 27.41,8.69 U8.5 ; 26.14,5.74 26.14,1.77 H6.8 ; 25.08,6.81 26.14,5.74 ; v2(24.71,8.69) 27.41,8.69
  Bottom Layer w0.2: v1(11.09,6.88) 11.09,8.31 12.59,9.81 15.95,9.81 17.07,8.69 v2(24.71,8.69) 26.01,7.39 v1(26.01,6.77)
RBG0: length 1.4
  Top Layer w0.15: LED4.2 15.76,11.73 16.12,11.36 16.12,11.24 16.39,10.97 U1.39
RGB1: length 1.3
  Top Layer w0.15: LED4.3 16.39,10.47 U1.40
RGB2: length 2.1
  Top Layer w0.15: LED4.4 15.13,11.1 16.27,9.97 U1.41
SCK: length 26.5
  Top Layer w0.2: U8.6 29.31,8.81 v1(28.63,8.12) 24.82,8.12 24.29,7.58 v2(24.08,7.58) 23.97,7.47 ; 25.08,5.53 25.06,5.51 v1(25.06,5.01) ; U7.6 13.48,8.78 v1(13.54,8.83) ; U1.15 23.97,7.47
  Bottom Layer w0.2: v1(13.54,8.83) 14.93,8.83 16.18,7.58 v2(24.08,7.58) 24.08,7.56 25.06,6.58 25.06,5.02 v1(25.06,5.01) 25.06,4.15 23.21,2.3 H6.7
SCS: length 30.6
  Top Layer w0.2: v2(24.31,8.24) 24.1,8.04 23.77,8.04 23.7,7.97 U1.16 ; H6.10 31.1,1.65 31.1,3 ; 11.66,7.52 11.66,6.95 v1(11.73,6.88)
  Top Layer w0.299: 31.1,3 32.26,3 ; 32.26,3 32.26,3.04 ; 32.26,3 32.26,2.56 v1(32.27,2.54)
  Bottom Layer w0.2: v1(32.27,2.54) 32.22,2.49 29.39,2.49 25.51,6.38 25.51,7.01 24.31,8.21 v2(24.31,8.24) 16.53,8.24 15.36,9.41 12.96,9.41 11.73,8.18 v1(11.73,6.88)
$1N838: length 1.9
  Top Layer w0.2: USB1.4 7.62,10.25 7.8,10.07
$1N2580: length 2
  Top Layer w0.2: 7.89,14.12 7.96,14.2 R3.2
  Top Layer w0.399: R3.2 C1.1
$1N7399: length 0.9
  Top Layer w0.2: BOOTLOADER.1 8.93,10.24 8.92,10.24
$1N8911: length 3
  Top Layer w0.2: RESET.1 12.82,10.99 13.32,10.99 R6.1 13.65,9.62 13.28,9.25 12.94,9.25 U7.7
$1N10655: length 1.3
  Top Layer w0.299: 32.27,5.74 32.07,5.53 31.1,5.53
$1N10681: length 1.4
  Top Layer w0.2: 25.08,4.27 24.02,4.27 23.81,4.05
$1N13098: length 1.3
  Top Layer w0.2: USB1.10 R1.1
$1N13176: length 1.1
  Top Layer w0.5: 9.78,3.6 R11.1
$1N14812: length 1.4
  Top Layer w0.2: R4.2 20.85,13.43 20.85,12.64 U1.29
$1N18803: length 1.1
  Top Layer w0.5: 26.71,11.32 R16.2
$1N18868: length 1.1
  Top Layer w0.5: 25.7,11.28 R17.2
$1N23642: length 1.9
  Top Layer w0.2: X2.1 13.18,12.77 R20.1
$1N41099: length 1.3
  Top Layer w0.299: 11.06,12.18 R12.1 ; LED2.2 10.71,12.53 11.06,12.18
$1N41101: length 1.2
  Top Layer w0.2: 12.16,11.36 R12.2 ; 12.16,10.52 12.16,11.36
$1N42332: length 2.6
  Top Layer w0.154: R18.1 16.09,8.47 U1.44
$1N42360: length 2.4
  Top Layer w0.154: U1.47 16.03,6.97 15.11,6.05 R19.1

## Copper pours and planes (outline as drawn; the poured copper is in the pictures)
+3V3 on Inner2: -0.59,17.56 32.55,17.56 32.55,-0.61 -0.59,-0.61
GND on Bottom Layer: -0.09,18 33.66,18 33.66,-0.05 -0.09,-0.05
GND on Inner1: 0.26,17.74 32.74,17.74 32.74,0.26 0.26,0.26

Small or netless copper shapes (teardrops, artwork), in the pictures only: 20 on Inner1

## Text on the board
Bottom Silkscreen Layer: ICE PRO V1.0 | VBUS | GND | 3.3V | 1.2V | 45A | 4A | 48B | 6A | 44B | 8A | 43A | SCK | 39A | MOSI | 36B | MISO | 37A | SCS
Top Silkscreen Layer: Rudy | Designed By
